# Altium project PCB_Tx.PrjPcb
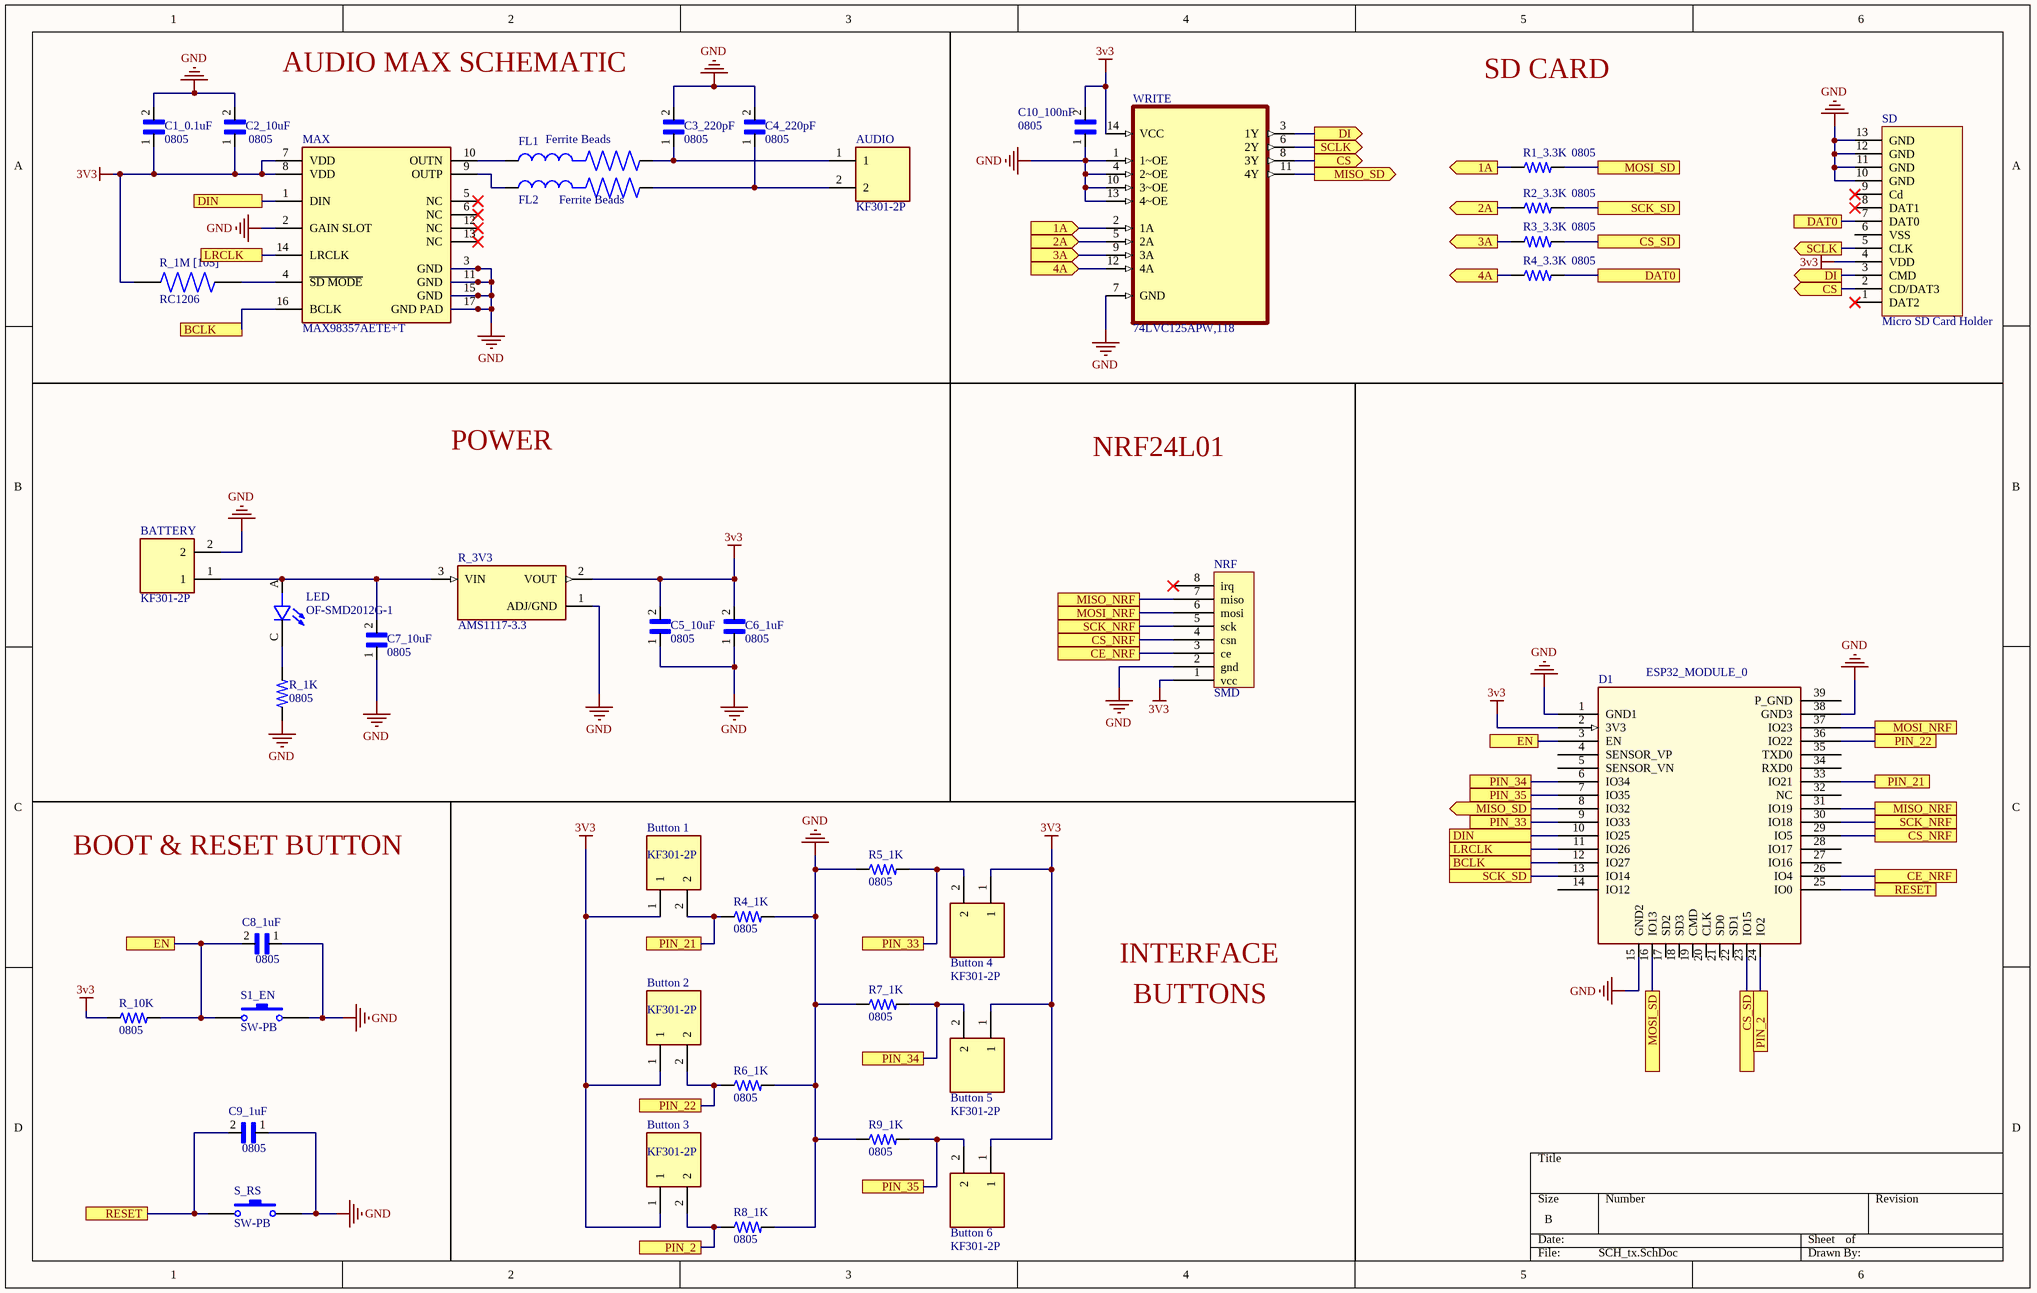
[diagram p0: SCH_tx.SchDoc]
1 sheet, 42 parts. Net scope: flat (ports and power ports of the same name join across sheets).
Board files: PCB_Tx.PcbDoc, ESP32-Sense Kit Motherboard.PcbDoc

## Sheet SCH_tx.SchDoc
size B; SheetNumber: 1; SheetTotal: 1

### Parts
AUDIO  KF301-2P  [HANDSON_KF301-2P]
BATTERY  KF301-2P  [HANDSON_KF301-2P]
Button_1  KF301-2P  [HANDSON_KF301-2P]
Button_2  KF301-2P  [HANDSON_KF301-2P]
Button_3  KF301-2P  [HANDSON_KF301-2P]
Button_4  KF301-2P  [HANDSON_KF301-2P]
Button_5  KF301-2P  [HANDSON_KF301-2P]
Button_6  KF301-2P  [HANDSON_KF301-2P]
C1_0.1uF  0805  [CAPC2012X94N]
C2_10uF  0805  [CAPC2012X94N]
C3_220pF  0805  [CAPC2012X94N]
C4_220pF  0805  [CAPC2012X94N]
C5_10uF  0805  [CAPC2012X94N]
C6_1uF  0805  [CAPC2012X94N]
C7_10uF  0805  [CAPC2012X94N]
C8_1uF  0805  [CAPC2012X94N]
C9_1uF  0805  [CAPC2012X94N]
C10_100nF  0805  [CAPC2012X94N]
D1  ESP32_MODULE_0  [MODULE_ESP32-WROOM-32D]
FL1  Ferrite Beads  [BEADC2012X105N]
FL2  Ferrite Beads  [BEADC2012X105N]
LED  OF-SMD2012G-1  [LEDSC125X200X83-2N]
MAX  Part Number: MAX98357AETE+T  [Maxim_Electronics_21-0896_0]
NRF  SMD  [NRF24L01]
R1_3.3K  0805  [RESC2012X65N]
R2_3.3K  0805  [RESC2012X65N]
R3_3.3K  0805  [RESC2012X65N]
R4_1K  0805  [RESC2012X65N]
R4_3.3K  0805  [RESC2012X65N]
R5_1K  0805  [RESC2012X65N]
R6_1K  0805  [RESC2012X65N]
R7_1K  0805  [RESC2012X65N]
R8_1K  0805  [RESC2012X65N]
R9_1K  0805  [RESC2012X65N]
R_1K  0805  [RESC2012X65N]
R_1M_[105]  RC1206  [RESC3116X65N]
R_3V3  AMS1117-3.3  [SOT229P700X180-4N]
R_10K  0805  [RESC2012X65N]
S1_EN  SW-PB  [SKRK]
S_RS  SW-PB  [SKRK]
SD  Micro SD Card Holder  [Micro SD Card Holder]
WRITE  74LVC125APW,118  [SOP65P640X110-14N]

### Ports
1A (in), 1A (out), 2A (in), 2A (out), 3A (in), 3A (out), 4A (in), 4A (out), BCLK, CE_NRF, CS (out), CS_NRF, CS_SD, DAT0, DI (out), DIN, EN, LRCLK, MISO_NRF, MISO_SD (out), MOSI_NRF, MOSI_SD, PIN_2, PIN_21, PIN_22, PIN_33, PIN_34, PIN_35, RESET, SCK_NRF, SCK_SD, SCLK (out)

### Nets
3V3: Button_1.1 Button_2.1 Button_3.1 Button_4.1 Button_5.1 Button_6.1 C1_0.1uF.1 C2_10uF.1 C5_10uF.2 C6_1uF.2 C10_100nF.2 D1.2(3V3) MAX.7(VDD) MAX.8(VDD) NRF.1(vcc) R_1M_[105].2 R_3V3.2(VOUT) R_10K.1 SD.4(VDD) WRITE.14(VCC)
GND: BATTERY.2 C1_0.1uF.2 C2_10uF.2 C3_220pF.2 C4_220pF.2 C5_10uF.1 C6_1uF.1 C7_10uF.1 C8_1uF.1 C9_1uF.1 C10_100nF.1 D1.1(GND1) D1.15(GND2) D1.38(GND3) MAX.2(GAIN_SLOT) MAX.3(GND) MAX.11(GND) MAX.15(GND) MAX.17(GND_PAD) NRF.2(gnd) R4_1K.2 R5_1K.1 R6_1K.2 R7_1K.1 R8_1K.2 R9_1K.1 R_1K.1 R_3V3.1(ADJ/GND) S1_EN.2 S_RS.2 SD.10(GND) SD.11(GND) SD.12(GND) SD.13(GND) WRITE.1(1~OE) WRITE.4(2~OE) WRITE.7(GND) WRITE.10(3~OE) WRITE.13(4~OE)
NetAUDIO_1: AUDIO.1 C3_220pF.1 FL1.2
NetAUDIO_2: AUDIO.2 C4_220pF.1 FL2.2
NetBATTERY_1: BATTERY.1 C7_10uF.2 LED.A R_3V3.3(VIN)
NetButton_1_2: Button_1.2 D1.33(IO21) R4_1K.1 ; port PIN_21
NetButton_2_2: Button_2.2 D1.36(IO22) R6_1K.1 ; port PIN_22
NetButton_3_2: Button_3.2 D1.24(IO2) R8_1K.1 ; port PIN_2
NetButton_4_2: Button_4.2 D1.9(IO33) R5_1K.2 ; port PIN_33
NetButton_5_2: Button_5.2 D1.6(IO34) R7_1K.2 ; port PIN_34
NetButton_6_2: Button_6.2 D1.7(IO35) R9_1K.2 ; port PIN_35
NetC8_1uF_2: C8_1uF.2 D1.3(EN) R_10K.2 S1_EN.1 ; port EN
NetC9_1uF_2: C9_1uF.2 D1.25(IO0) S_RS.1 ; port RESET
NetD1_8: D1.8(IO32) WRITE.11(4Y) ; port MISO_SD
NetD1_10: D1.10(IO25) MAX.1(DIN) ; port DIN
NetD1_11: D1.11(IO26) MAX.14(LRCLK) ; port LRCLK
NetD1_12: D1.12(IO27) MAX.16(BCLK) ; port BCLK
NetD1_13: D1.13(IO14) R2_3.3K.2 ; port SCK_SD
NetD1_16: D1.16(IO13) R1_3.3K.2 ; port MOSI_SD
NetD1_23: D1.23(IO15) R3_3.3K.2 ; port CS_SD
NetD1_26: D1.26(IO4) NRF.3(ce) ; port CE_NRF
NetD1_29: D1.29(IO5) NRF.4(csn) ; port CS_NRF
NetD1_30: D1.30(IO18) NRF.5(sck) ; port SCK_NRF
NetD1_31: D1.31(IO19) NRF.7(miso) ; port MISO_NRF
NetD1_37: D1.37(IO23) NRF.6(mosi) ; port MOSI_NRF
NetFL1_1: FL1.1 MAX.10(OUTN)
NetFL2_1: FL2.1 MAX.9(OUTP)
NetLED_C: LED.C R_1K.2
NetMAX_4: MAX.4(~{SD_MODE}) R_1M_[105].1
NetR1_3.3K_1: R1_3.3K.1 WRITE.2(1A) ; port 1A
NetR2_3.3K_1: R2_3.3K.1 WRITE.5(2A) ; port 2A
NetR3_3.3K_1: R3_3.3K.1 WRITE.9(3A) ; port 3A
NetR4_3.3K_1: R4_3.3K.1 WRITE.12(4A) ; port 4A
NetR4_3.3K_2: R4_3.3K.2 SD.7(DAT0) ; port DAT0
NetSD_2: SD.2(CD/DAT3) WRITE.8(3Y) ; port CS
NetSD_3: SD.3(CMD) WRITE.3(1Y) ; port DI
NetSD_5: SD.5(CLK) WRITE.6(2Y) ; port SCLK

Not connected (* = marked no-connect by the designer): D1 4(SENSOR_VP) 5(SENSOR_VN) 14(IO12) 17(SD2) 18(SD3) 19(CMD) 20(CLK) 21(SD0) 22(SD1) 27(IO16) 28(IO17) 32(NC) 34(RXD0) 35(TXD0) 39(P_GND); MAX 5(NC)* 6(NC)* 12(NC)* 13(NC)*; NRF 8(irq)*; SD 1(DAT2)* 6(VSS) 8(DAT1)* 9(Cd)*

### Notes on the sheet
- AUDIO MAX SCHEMATIC
- SD CARD
- POWER
- NRF24L01
- BOOT & RESET BUTTON
- INTERFACE
- BUTTONS

### Library data of the parts
AUDIO BATTERY Button_1-Button_6 = KF301-2P: 2 Pin Terminal Block 5mm Pitch; MF: Handson Technology; Availability: Unavailable; MP: KF301-2P; Price: None; Value: *; SnapEDA_Link: https://www.snapeda.com/parts/KF301-2P/Handson%20Technology/view-part/4276957/?ref=snap; Package: Package
C1_0.1uF C2_10uF C3_220pF C4_220pF C5_10uF C6_1uF C7_10uF C8_1uF C9_1uF C10_100nF = 0805YC103J4T2A: 10000pF Â±5% 16V Ceramic Capacitor X7R 0805 _2012 Metric_; MF: AVX; Package: 2012 AVX; Availability: Unavailable; Value: *; MP: 0805YC103J4T2A; SnapEDA_Link: https://www.snapeda.com/parts/0805YC103J4T2A/AVX/view-part/606803/?ref=snap; Price: None
FL1 FL2 = BLM21PG221BH1D: Package: None; Price: None; Value: *; MP: BLM21PG221BH1D; Availability: Unavailable
LED = OF-SMD2012G-1: LED; SMD; 0805; green; 600-800mcd; 2x1.25mm; 120Â°; Î»d: 5; MF: Optoflash; MP: OF-SMD2012G-1; Package: 0805 Optoflash; Price: None; Value: *; SnapEDA_Link: https://www.snapeda.com/parts/OF-SMD2012G-1/Optoflash/view-part/560281/?ref=snap; Availability: Unavailable
MAX = IC_Maxim_Electronics_MAX98357AETE+T_eec: IC Amplifier IC 2-Channel (Stereo) Class D 16-TQFN (3x3); Manufacturer: Maxim Electronics; Mfg Package Ident: 21-0896; helpURL: https://upverter.com/upn/revision/0f54a4b5bdb80fd2/; ComponentLink2Description: Datasheet; Temperature: +40°C to +85°C; Package: 21-0896; Supplier 2: Mouser; Price: 1.00367999051; Supplier 1: Digi-Key; ComponentLink1URL: https://upverter.com/upn/revision/0f54a4b5bdb80fd2/; Supplier Part Number 2: 700-MAX98357AETE+T; Supplier Part Number 1: MAX98357AETE+T-ND; ComponentLink1Description: Upverter; ComponentLink2URL: http://datasheets.maximintegrated.com/en/ds/MAX98357A-MAX98357B.pdf; RoHS: TRUE; Mouser Part Number: 700-MAX98357AETE+T; Temperature Range High: +85°C; Digikey Description: IC Amplifier IC 2-Channel (Stereo) Class D 16-TQFN (3x3); Digikey Part Number: MAX98357AETE+T-ND; Lead Free: yes; Temperature Range Low: +40°C
NRF = nrf24l01_smd
R1_3.3K R2_3.3K R3_3.3K R4_1K R4_3.3K R5_1K R6_1K R7_1K R8_1K R9_1K R_1K R_10K = 2-2176053-0: RES 0.33 OHM 1% 1/4W 0805; Resistance: .33; MF: TE Connectivity; Power_Rating: .25 W; Price: None; EU_RoHS_Compliance: Compliant with Exemptions; Tolerance: 1%; MP: 2-2176053-0; Value: *; Availability: Unavailable; SnapEDA_Link: https://www.snapeda.com/parts/2-2176053-0/TE%20Connectivity/view-part/2214508/?ref=snap; Package: 0805
R_1M_[105] = RC1206JR-0713RL: 13 Ohms Â±5% 0.25W, 1/4W Chip Resistor 1206 _3216 Metric_ Moisture Resistant Thick Film; MF: Yageo; MP: RC1206JR-0713RL; Availability: Unavailable; SnapEDA_Link: https://www.snapeda.com/parts/RC1206JR-0713RL/Yageo/view-part/105893/?ref=snap; Package: 3116 Yageo; Value: *; Price: None
R_3V3 = AMS1117-3.3: Sot223/Pkg 1-Amp 3.3-Volt Low Drop Out Voltage Regulatator; MF: Advanced Monolithic Systems; Price: None; Package: None; Value: *; MP: AMS1117-3.3; Availability: Unavailable; SnapEDA_Link: https://www.snapeda.com/parts/AMS1117-3.3/Advanced%20Monolithic%20Systems/view-part/53450/?ref=snap
S1_EN S_RS = SW-PB: Switch; Published: 24-Mar-1999; LatestRevisionDate: 17-Jul-2002; LatestRevisionNote: Re-released for DXP Platform.; PackageReference: SPST-2; Publisher: Altium Limited; PackageDescription: Switch; 2 Leads
WRITE = 74LVC125APW,118: IC BUF NON-INVERT 3.6V 14TSSOP; MF: Nexperia USA Inc.; MP: 74LVC125APW,118; Availability: Good; SnapEDA_Link: https://www.snapeda.com/parts/74LVC125APW,118/Nexperia/view-part/5160321/?ref=snap; Check_prices: https://www.snapeda.com/parts/74LVC125APW,118/Nexperia/view-part/5160321/?ref=eda; Value: *; Purchase-URL: https://pricing.snapeda.com/search/part/74LVC125APW,118/?ref=eda; Package: None; Price: None